# EAGLE design eeprom_adapter (EAGLE 7.3.0)
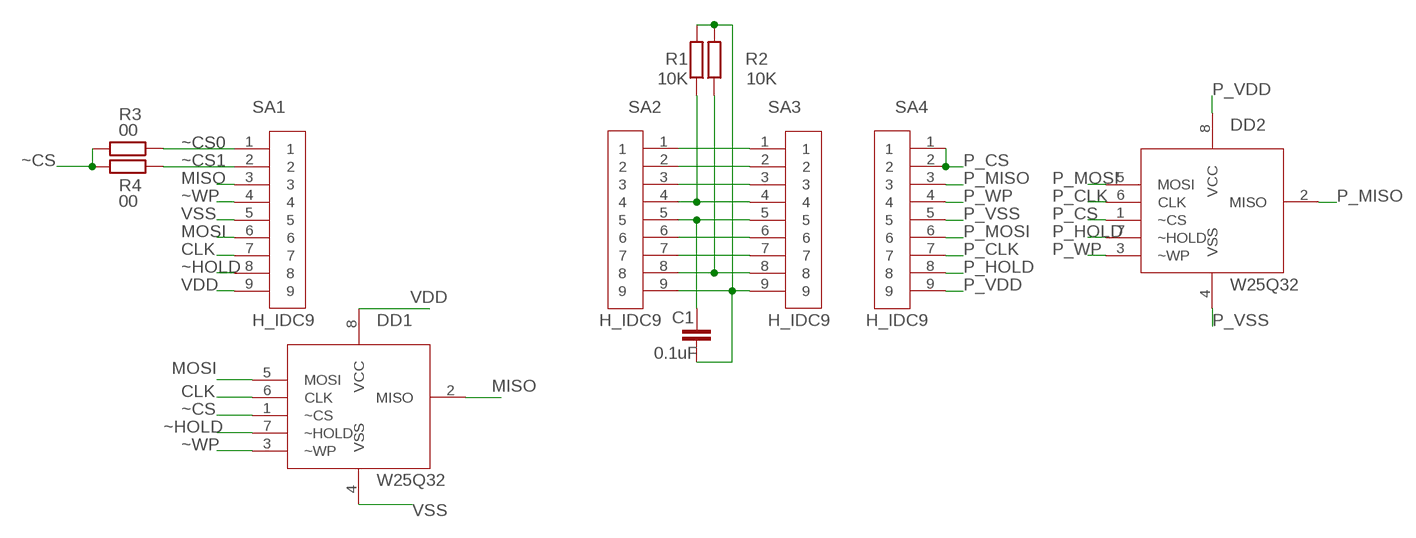
[diagram p0: schematic, sheet 1]

## Parts
C1  0.1uF  C-EUC0603  [C0603]
DD1  W25Q32  W25Q32SOIC208  [SOIC-208]
DD2  W25Q32  W25Q32H_DIP8  [H_DIL08]
R1  10K  R-EU_R0603  [R0603]
R2  10K  R-EU_R0603  [R0603]
R3  00  R-EU_R0603  [R0603]
R4  00  R-EU_R0603  [R0603]
SA1  H_IDC9  [H_IDC8X1_27]
SA2  H_IDC9  [H_IDC8X1_27]
SA3  H_IDC9  [H_IDC8X1_27]
SA4  H_IDC9  [H_IDC8X1_27]

## Nets
CLK: DD1.6(CLK) SA1.7
MISO: DD1.2(MISO) SA1.3
MOSI: DD1.5(MOSI) SA1.6
N$1: SA2.1 SA3.1
N$2: SA2.2 SA3.2
N$3: SA2.3 SA3.3
N$4: R1.1 SA2.4 SA3.4
N$5: C1.1 SA2.5 SA3.5
N$6: SA2.6 SA3.6
N$7: SA2.7 SA3.7
N$8: R2.1 SA2.8 SA3.8
N$10: C1.2 R1.2 R2.2 SA2.9 SA3.9
P_CLK: DD2.6(CLK) SA4.7
P_CS: DD2.1(~CS) SA4.1 SA4.2
P_HOLD: DD2.7(~HOLD) SA4.8
P_MISO: DD2.2(MISO) SA4.3
P_MOSI: DD2.5(MOSI) SA4.6
P_VDD: DD2.8(VCC) SA4.9
P_VSS: DD2.4(VSS) SA4.5
P_WP: DD2.3(~WP) SA4.4
VDD: DD1.8(VCC) SA1.9
VSS: DD1.4(VSS) SA1.5
~CS: DD1.1(~CS) R3.2 R4.2
~CS0: R3.1 SA1.1
~CS1: R4.1 SA1.2
~HOLD: DD1.7(~HOLD) SA1.8
~WP: DD1.3(~WP) SA1.4

## Library data of the parts
C1 = resistors:C-EU: CAPACITOR, European symbol
DD1 DD2 = eeprom:W25Q32
R1-R4 = resistors:R-EU_: RESISTOR, European symbol
SA1-SA4 = connectors:H_IDC9

## Board
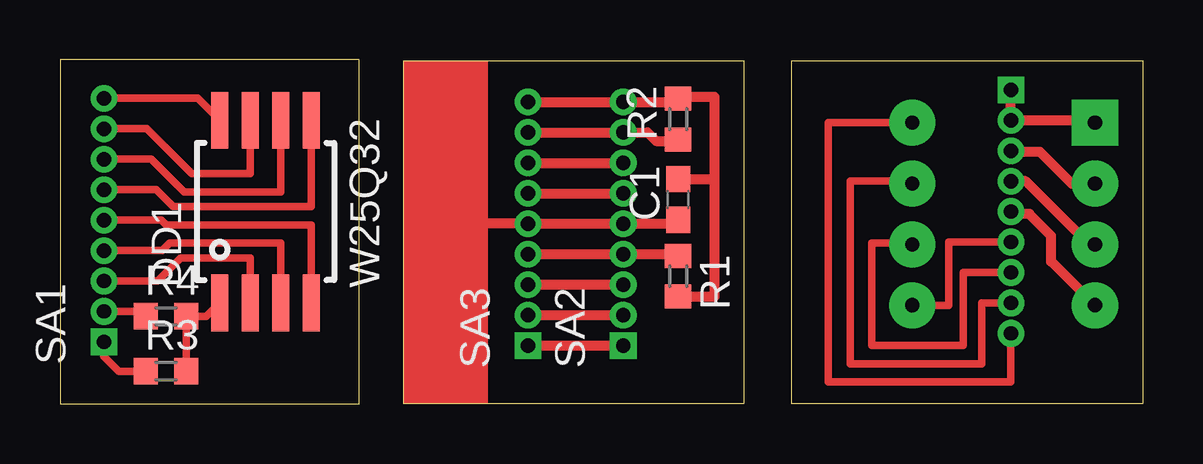
[diagram p1: board, top side]
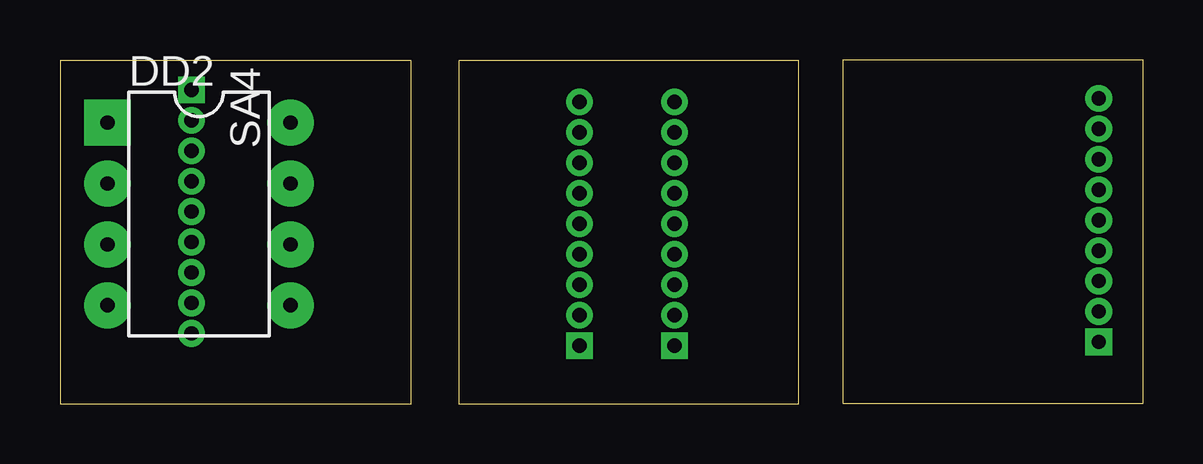
[diagram p2: board, bottom side, seen from below]

Size 45.11 x 14.35 mm. Coordinates in mm from the lower left corner, seen from the top.
Outline: 0,0 12.48,0 12.48,14.35 0,14.35 0,0
Outline: 14.33,14.33 28.5,14.33 28.5,0 14.33,0 14.33,14.33
Outline: 30.48,14.33 45.11,14.33 45.11,0 30.48,0 30.48,14.33
Copper layers (1*16): Top 0.035mm / dielectric 1.5mm / Bottom 0.035mm
Design rules "default": minimum track width 10mil, minimum drill 24mil, track to track 8mil, track to pad 8mil, pad to pad 8mil, via to via 8mil, smd to smd 8mil, copper to edge 40mil, drill to drill 8mil, minimum pad ring 10mil, minimum via ring 8mil, stop-mask expansion 4mil, vias tented up to drill 0mil, thermal gap 10mil

### Footprints (pad centres in the part's own frame; a part is rotated, then mirrored left to right if it is on the bottom)
C0603 = smd 1.1 x 1: 1 -0.85,0; 2 0.85,0
SOIC-208 = smd 0.7 x 2.36: 1 0,0; 2 1.27,0; 3 2.54,0; 4 3.81,0; 5 3.81,7.62; 6 2.54,7.62; 7 1.27,7.62; 8 0,7.62
H_DIL08 = drill 0.6 pad 1.93 square: 1 -3.81,-3.81 | drill 0.6 pad 1.93: 2 -1.27,-3.81; 3 1.27,-3.81; 4 3.81,-3.81; 5 3.81,3.81; 6 1.27,3.81; 7 -1.27,3.81; 8 -3.81,3.81
R0603 = smd 1 x 1.1: 1 -0.85,0; 2 0.85,0
H_IDC8X1_27 = drill 0.6 pad 1.016 square: 1 0,0 | drill 0.6 pad 1.016: 2 1.27,0; 3 2.54,0; 4 3.81,0; 5 5.08,0; 6 6.35,0; 7 7.62,0; 8 8.89,0; 9 10.16,0

### Placement (x,y rotation side)
C1  25.76,8.53 90 top
DD1  6.65,4.22 0 top
DD2  39.32,7.92 270 bottom
R1  25.76,5.33 270 top
R2  25.76,11.89 90 top
R3  4.42,1.37 0 top
R4  4.42,3.66 0 top
SA1  1.83,2.59 90 top
SA2  23.47,2.44 90 top
SA3  19.51,2.44 90 top
SA4  39.62,13.11 270 bottom

### Tracks (layer width: path | path; a pad name or v marks a point on that pad's centre or on a via)
CLK
  Top 0.305: SA1.7 3.81,10.21 5.18,8.84 9.2,8.84 DD1.6
MISO
  Top 0.305: SA1.3 4.06,5.13 5.03,6.1 7.92,6.1 DD1.2
MOSI
  Top 0.305: SA1.6 4.01,8.94 4.72,8.23 10.46,8.23 DD1.5
N$1
  Top 0.406: SA3.1 SA2.1
N$2
  Top 0.406: SA3.2 SA2.2
N$3
  Top 0.406: SA3.3 SA2.3
N$4
  Top 0.406: SA3.4 SA2.4 25.69,6.25 R1.1
N$5
  Top 0.406: 16.46,7.47 16.46,7.52 SA3.5 SA2.5 25.59,7.52 C1.1
N$6
  Top 0.406: SA3.6 SA2.6
N$7
  Top 0.406: SA3.7 SA2.7
N$8
  Top 0.406: SA3.8 SA2.8 24.49,11.33 24.84,10.97 25.69,10.97 R2.1
N$10
  Top 0.406: SA3.9 SA2.9 25.62,12.6 R2.2 25.76,12.8 27.28,12.8 27.28,9.45 27.28,9.38 | R1.2 27.28,4.48 27.28,9.38 | C1.2 27.28,9.38
P_CLK
  Top 0.305: SA4.7 37.64,5.49 37.64,2.44 33.83,2.44 33.83,6.71 35.51,6.71 DD2.6
P_CS
  Top 0.406: DD2.1 43.13,11.84 SA4.2 SA4.1
P_HOLD
  Top 0.305: SA4.8 38.41,4.22 38.41,1.68 32.92,1.68 32.92,9.3 35.51,9.3 DD2.7
P_MISO
  Top 0.406: DD2.2 42.16,9.2 40.84,10.52 39.67,10.52 SA4.3
P_MOSI
  Top 0.305: SA4.6 37.03,6.76 37.03,4.12 DD2.5
P_VDD
  Top 0.305: SA4.9 39.62,0.91 32,0.91 32,11.73 DD2.8
P_VSS
  Top 0.406: DD2.4 41.3,5.94 41.3,7.01 40.39,7.92 39.73,7.92 SA4.5
P_WP
  Top 0.406: DD2.3 42.88,6.66 40.23,9.3 SA4.4
VDD
  Top 0.305: SA1.9 5.74,12.75 DD1.8
VSS
  Top 0.305: SA1.5 4.22,7.67 4.42,7.47 10.46,7.47 DD1.4
~CS
  Top 0.305: R3.2 R4.2 6.1,3.66 DD1.1
  Top 0.406: 6.66,4.93 DD1.1
~CS0
  Top 0.305: SA1.1 1.83,1.98 2.44,1.37 R3.1
~CS1
  Top 0.305: SA1.2 3.37,3.86 R4.1
~HOLD
  Top 0.305: SA1.8 3.61,11.48 5.49,9.6 7.92,9.6 DD1.7
~WP
  Top 0.305: SA1.4 4.27,6.4 4.57,6.71 9.2,6.71 DD1.3
(copper drawn outside any net)
  shapes: Top area x1